# Altium schematic sheet Chap11 .SchDoc
size A4
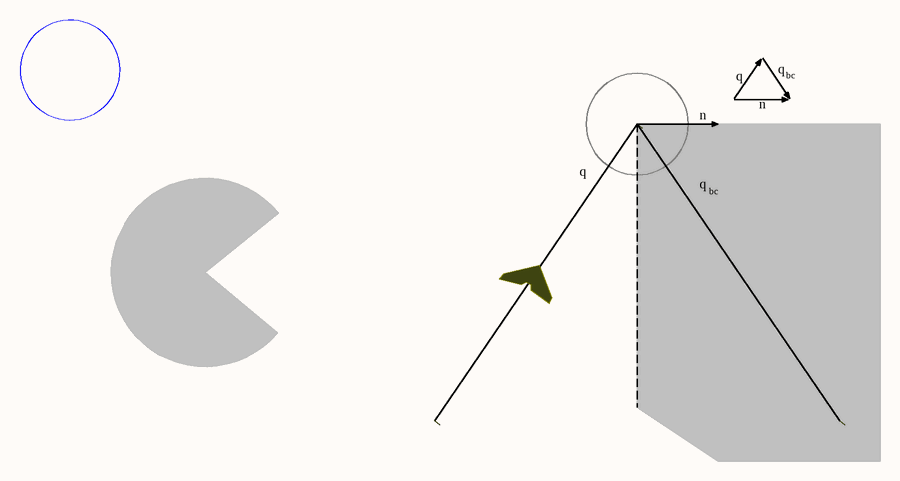
[diagram p0: Chap11 .SchDoc]

## Notes on the sheet
- q
- n
- bc